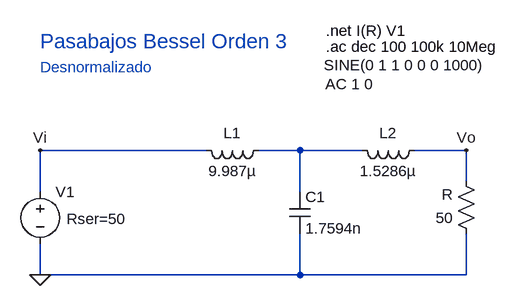
[diagram p0: schematic Circuito_Desnormalizado.asc]
Circuito_Desnormalizado.asc, the LTspice schematic file:
Version 4
SHEET 1 880 680
WIRE 240 96 -16 96
WIRE 384 96 320 96
WIRE 480 96 384 96
WIRE 640 96 560 96
WIRE 640 144 640 96
WIRE -16 160 -16 96
WIRE 384 160 384 96
WIRE -16 288 -16 240
WIRE 384 288 384 224
WIRE 384 288 -16 288
WIRE 640 288 640 224
WIRE 640 288 384 288
FLAG -16 288 0
FLAG 640 96 Vo
FLAG -16 96 Vi
SYMBOL res 656 240 R180
WINDOW 0 36 76 Left 2
WINDOW 3 36 40 Left 2
SYMATTR InstName R
SYMATTR Value 50
SYMBOL ind 336 80 R90
WINDOW 0 5 56 VBottom 2
WINDOW 3 32 56 VTop 2
SYMATTR InstName L1
SYMATTR Value 9.987µ
SYMBOL ind 576 80 R90
WINDOW 0 5 56 VBottom 2
WINDOW 3 32 56 VTop 2
SYMATTR InstName L2
SYMATTR Value 1.5286µ
SYMBOL cap 368 160 R0
SYMATTR InstName C1
SYMATTR Value 1.7594n
SYMBOL voltage -16 144 R0
WINDOW 3 437 -179 Left 2
WINDOW 123 439 -150 Left 2
WINDOW 39 41 58 Left 2
SYMATTR Value SINE(0 1 1 0 0 0 1000)
SYMATTR Value2 AC 1 0
SYMATTR SpiceLine Rser=50
SYMATTR InstName V1
TEXT 424 -64 Left 2 !.ac dec 100 100k 10Meg
TEXT 424 -88 Left 2 !.net I(R) V1
TEXT -16 -72 Left 3 ;Pasabajos Bessel Orden 3
TEXT -16 -32 Left 2 ;Desnormalizado

The netlist it stands for:
* Circuito_Desnormalizado.asc
R 0 Vo 50
L1 N001 Vi 9.987µ
L2 Vo N001 1.5286µ
C1 N001 0 1.7594n
V1 Vi 0 SINE(0 1 1 0 0 0 1000) AC 1 0 Rser=50
.ac dec 100 100k 10Meg
.net I(R) V1
* Pasabajos Bessel Orden 3
* Desnormalizado
.backanno
.end

* Results of the author's LTspice run, read from the files saved beside the schematic
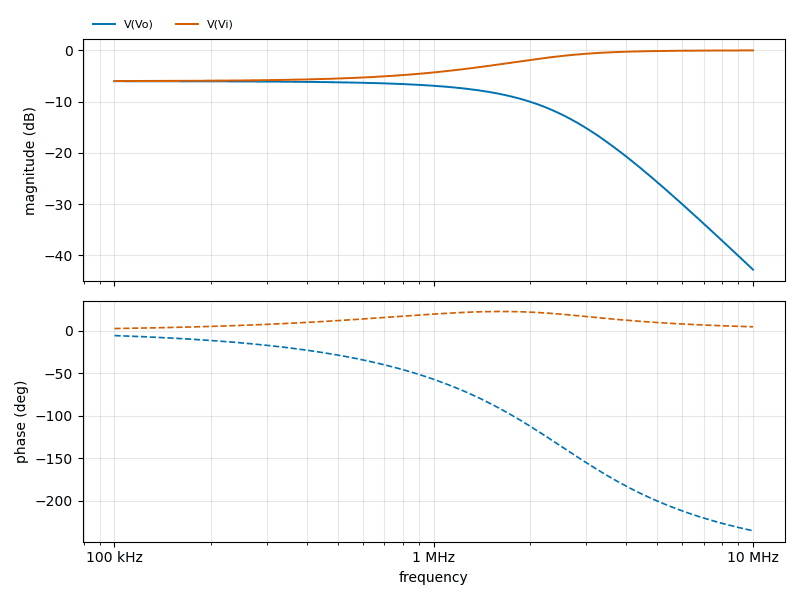
[diagram p1: AC Analysis of Circuito_Desnormalizado.asc, plotted from the saved traces]
* AC Analysis, 1 run:
*   V(Vo): -6.03 dB at 100 kHz, -42.77 dB at 10 MHz, peak -6.03 dB at 100 kHz, 3 dB below the peak at 1.758 MHz
*   V(Vi): -6.00 dB at 100 kHz, -0.03 dB at 10 MHz, peak -0.03 dB at 10 MHz, 3 dB below the peak at 1.486 MHz